# EAGLE design digAudio-rcj-tg10da1nslf (EAGLE 8.6.0)
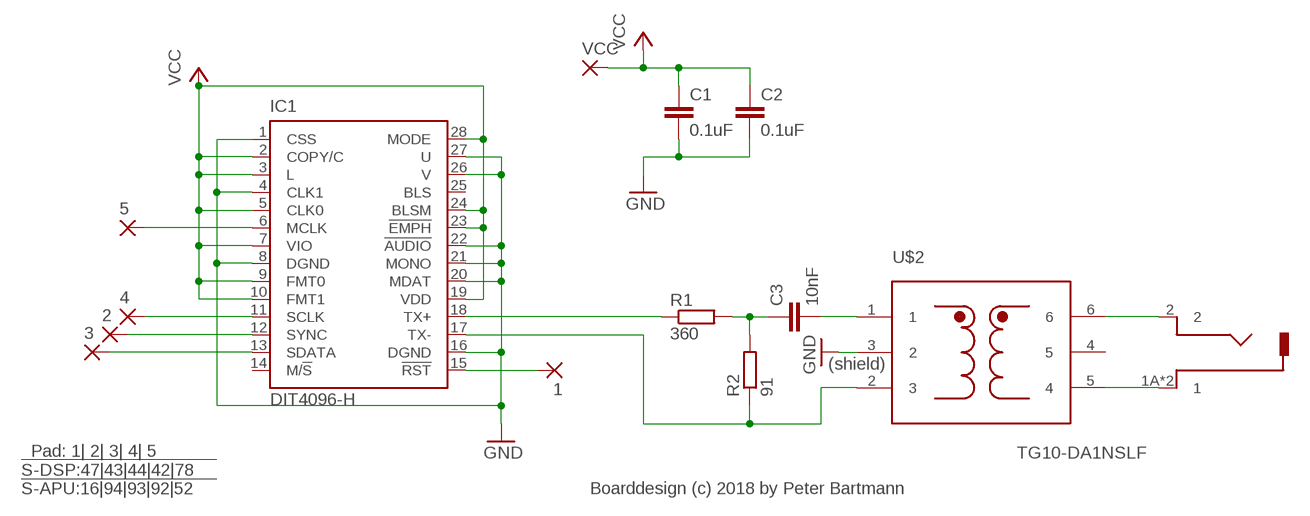
[diagram p0: schematic, sheet 1]

## Parts
1  SMD1  [SMD0,8-1,6]
2  SMD1  [SMD0,8-1,6]
3  SMD1  [SMD0,8-1,6]
4  SMD1  [SMD0,8-1,6]
5  SMD1  [SMD0,8-1,6]
C1  0.1uF  C-EUC0603  [C0603]
C2  0.1uF  C-EUC0603  [C0603]
C3  10nF  C-EUC0603  [C0603]
IC1  DIT4096-H  DIT4192-H  [PW_R-PDSO-G28]
R1  360  R-EU_R0603  [R0603]
R2  91  R-EU_R0603  [R0603]
U$1  RCJ-013-SMT-TR  RCJ_01X_SMT-MODIFIED  [RCJ_01X_SMT_MODIFIED]
U$2  TG10-DA1NSLF  [TG10-DA1NSFL]
VCC  SMD2  [SMD1,27-2,54]

## Nets
GND: C1.2 C2.2 IC1.1(CSS) IC1.4(CLK1) IC1.8(DGND) IC1.16(DGND) IC1.20(MDAT) IC1.21(MONO) IC1.22(!AUDIO) IC1.26(V) IC1.27(U) U$2.3
N$1: IC1.18(TX+) R1.1
N$2: 1.P$1(P) IC1.15(!RST)
N$3: 2.P$1(P) IC1.12(SYNC)
N$4: 4.P$1(P) IC1.11(SCLK)
N$5: 3.P$1(P) IC1.13(SDATA)
N$6: 5.P$1(P) IC1.6(MCLK)
N$7: IC1.17(TX-) R2.1 U$2.2
N$8: C3.1 R1.2 R2.2
N$9: U$1.2 U$2.6
N$10: U$1.1A U$1.1B U$2.5
N$11: C3.2 U$2.1
VCC: C1.1 C2.1 IC1.2(COPY/C) IC1.3(L) IC1.5(CLK0) IC1.7(VIO) IC1.9(FMT0) IC1.10(FMT1) IC1.19(VDD) IC1.23(!EMPH) IC1.24(BLSM) IC1.28(MODE) VCC.1(P)
Unconnected: IC1.14(M/!S) IC1.25(BLS) U$2.4

## Notes on the sheet
- (shield)
- Pad: 1| 2| 3| 4| 5
  S-DSP:47|43|44|42|78
  S-APU:16|94|93|92|52
- Boarddesign (c) 2018 by Peter Bartmann

## Library data of the parts
1-5 = wirepad:SMD1
C1-C3 = rcl:C-EU: CAPACITOR, European symbol
IC1 = texas:DIT4192-H: 192kHz Digital Audio Transmitter Hardware Mode Source: http://focus.ti.com/lit/ds/symlink/dit4192.pdf; MF: TEXAS INSTRUMENTS; MPN: DIT4192IPW; OC_FARNELL: 7455057; OC_NEWARK: 74C9511
R1 R2 = rcl:R-EU_: RESISTOR, European symbol
U$1 = digAudio_SNES:RCJ_01X_SMT
U$2 = cs8406:TG10-DA1NSLF
VCC = wirepad:SMD2: SMD PAD

## Board
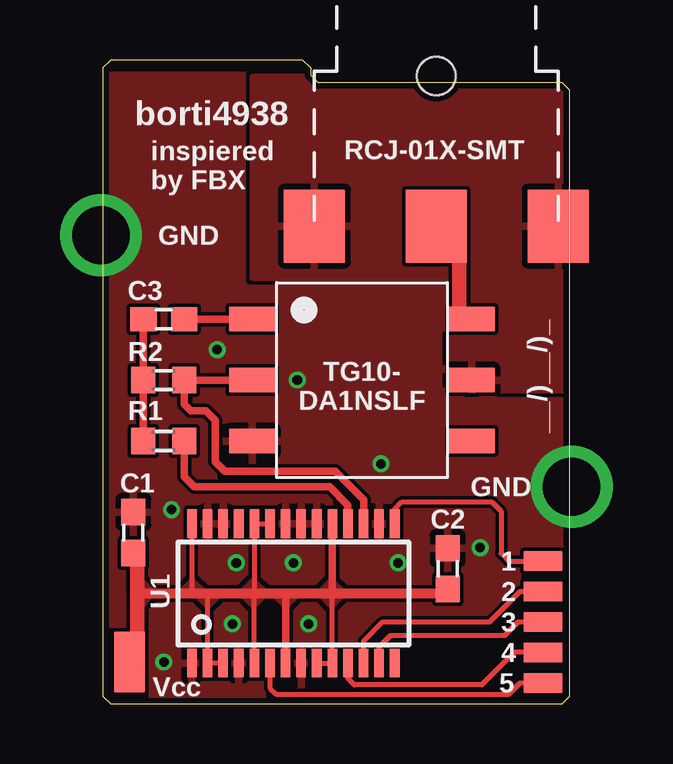
[diagram p1: board, top side]
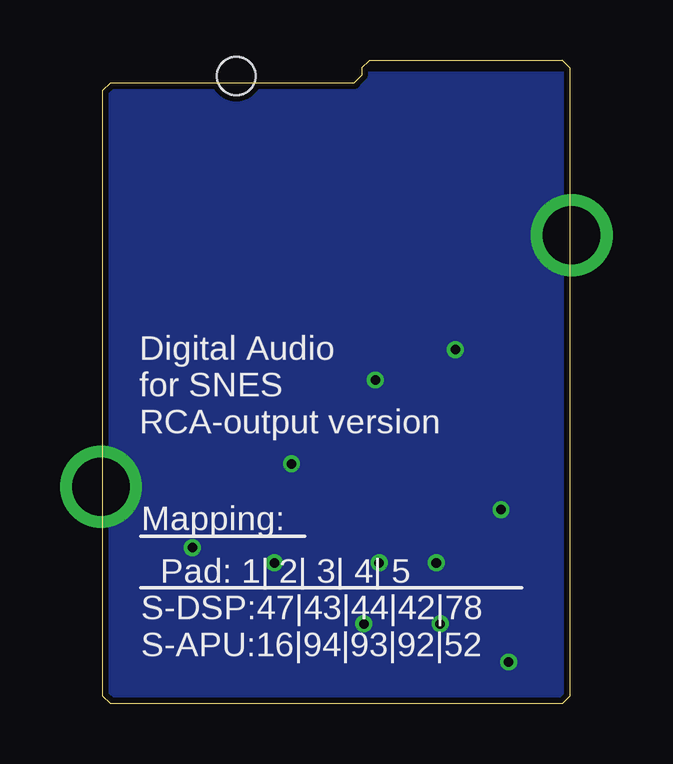
[diagram p2: board, bottom side, seen from below]

Size 19.45 x 26.83 mm. Coordinates in mm from the lower left corner, seen from the top.
Outline: 0,26.51 0,0.32 0.32,0 19.13,0 19.45,0.32 19.45,25.56 19.13,25.88 8.97,25.88 8.65,26.19 8.65,26.51 8.33,26.83 0.32,26.83 0,26.51
Copper layers (1*16): Top 0.035mm / dielectric 1.5mm / Bottom 0.035mm
Design rules "Elecrow_2-layer_eagle_rule": minimum track width 6mil, minimum drill 12mil, track to track 6mil, track to pad 6mil, pad to pad 6mil, via to via 6mil, smd to smd 0mil, copper to edge 10mil, drill to drill 10mil, minimum pad ring 10mil, minimum via ring 6mil, stop-mask expansion 2mil, vias tented up to drill 100mil, thermal gap 10mil

### Footprints (pad centres in the part's own frame; a part is rotated, then mirrored left to right if it is on the bottom)
SMD0,8-1,6 = smd 0.8 x 1.6: P$1 0,0
C0603 = smd 1.1 x 1: 1 -0.85,0; 2 0.85,0
PW_R-PDSO-G28 = smd 0.4 x 1.2: 1 -4.225,-2.9; 2 -3.575,-2.9; 3 -2.925,-2.9; 4 -2.275,-2.9; 5 -1.625,-2.9; 6 -0.975,-2.9; 7 -0.325,-2.9; 8 0.325,-2.9; 9 0.975,-2.9; 10 1.625,-2.9; 11 2.275,-2.9; 12 2.925,-2.9; 13 3.575,-2.9; 14 4.225,-2.9; 15 4.225,2.9; 16 3.575,2.9; 17 2.925,2.9; 18 2.275,2.9; 19 1.625,2.9; 20 0.975,2.9; 21 0.325,2.9; 22 -0.325,2.9; 23 -0.975,2.9; 24 -1.625,2.9; 25 -2.275,2.9; 26 -2.925,2.9; 27 -3.575,2.9; 28 -4.225,2.9
R0603 = smd 1 x 1.1: 1 -0.85,0; 2 0.85,0
RCJ_01X_SMT_MODIFIED = smd 3.048 x 2.54: 1A 0.254,-5.08; 1B 0.254,5.08; 2 0.254,0 | hole 1.6: -6,0
TG10-DA1NSFL = smd 1.905 x 1.016: 1 -4.572,2.54; 2 -4.572,0; 3 -4.572,-2.54; 4 4.572,-2.54; 5 4.572,0; 6 4.572,2.54
SMD1,27-2,54 = smd 1.27 x 2.54: 1 0,0

### Placement (x,y rotation side)
1  18.34,5.95 90 top
2  18.34,4.68 90 top
3  18.34,3.41 90 top
4  18.34,2.14 90 top
5  18.34,0.87 90 top
C1  1.27,7.14 90 top
C2  14.37,5.64 90 top
C3  2.54,16.03 0 top
IC1  7.94,4.6 0 top
R1  2.54,10.95 180 top
R2  2.54,13.49 180 top
U$1  13.89,20.16 270 top
U$2  10.79,13.49 0 top
VCC  1.11,1.75 180 top

### Tracks (layer width: path | path; a pad name or v marks a point on that pad's centre or on a via)
GND  (via drill 0.4, 2.4)
  other vias: -0.08,19.53 19.53,9.05 5.4,3.33 8.57,3.33 15.72,6.51 12.3,5.87 7.94,5.87 5.56,5.87 2.86,8.1 8.1,13.49 11.59,10 4.76,14.76 2.54,1.75
  pour Bottom (rank 6): 0.08,-0.48 19.68,-0.48 19.45,26.19 0.08,26.19
  pour Top (rank 6): 0.08,26.19 0.08,-0.48 19.68,-0.48 19.45,26.19
N$1
  Top 0.305: R1.1 3.39,9.47 3.81,9.05 9.45,9.05 10.21,8.28 IC1.18
N$2
  Top 0.203: IC1.15 12.16,8.11 12.46,8.41 16.19,8.41 16.59,8.02 16.59,6.27 16.91,5.95 1.P$1
N$3
  Top 0.203: IC1.12 10.86,2.61 11.67,3.41 16.11,3.41 17.38,4.68 2.P$1
N$4
  Top 0.203: 4.P$1 17.14,2.14 15.8,0.79 10.48,0.79 10.21,1.06 IC1.11
N$5
  Top 0.203: IC1.13 11.51,2.38 11.99,2.86 16.75,2.86 17.3,3.41 3.P$1
N$6
  Top 0.203: IC1.6 6.96,0.66 7.22,0.4 16.91,0.4 17.38,0.87 5.P$1
N$7
  Top 0.305: U$2.2 R2.1 3.39,12.48 3.65,12.22 4.29,12.22 4.68,11.83 4.68,10.08 5.08,9.68 9.68,9.68 10.86,8.5 IC1.17
N$8
  Top 0.305: R1.2 R2.2 C3.1
N$9
  Top 0.152: U$1.2 13.89,19.53
  Top 0.61: 13.89,19.53 14.84,19.53 14.84,16.03 U$2.6
N$10
  pour Top: 6.27,17.78 14.45,17.78 14.45,13.1 19.45,13.1 19.45,26.19 6.27,26.11
N$11
  Top 0.305: C3.2 U$2.1
VCC
  Top 0.203: IC1.28 3.71,4.7 3.81,4.6 | IC1.23 IC1.24 6.31,4.64 6.35,4.6 6.31,4.57 IC1.5 | 4.44,4.6 4.36,4.52 IC1.2 IC1.3 | IC1.9 IC1.10 9.56,4.6 9.52,4.6
  Top 0.305: IC1.7 7.61,4.6 7.62,4.6 | IC1.19 9.56,4.64 9.52,4.6
  Top 0.406: 1.43,4.6 3.81,4.6 4.44,4.6 6.35,4.6 7.62,4.6 9.52,4.6 14.11,4.6 C2.1
  Top 0.61: C1.1 1.43,6.13 1.43,4.6 1.43,1.75 VCC.1
  pour Top: 3.73,5.16 3.17,4.6 4.29,4.6
  pour Top: 6.27,5.16 5.71,4.6 6.83,4.6
  pour Top: 9.53,5.16 8.97,4.6 10.08,4.6
  pour Top: 7.62,4.05 8.18,4.6 7.06,4.6
  pour Top: 6.27,4.05 6.83,4.6 5.71,4.6
  pour Top: 4.37,4.05 4.92,4.6 3.81,4.6
  pour Top: 9.53,4.05 10.08,4.6 8.97,4.6
  pour Top: 2.14,4.6 1.43,5.32 1.43,3.89

### Text on the board
tNames: borti4938 | RCJ-01X-SMT | inspiered / by FBX | GND | C3 | R2 | TG10- / DA1NSLF | R1 | __/)__/)_ | C1 | GND | C2 | 1 | 2 | U1 | 3 | 4 | Vcc | 5
bNames: Digital Audio / for SNES / RCA-output version | Mapping: | Pad: 1| 2| 3| 4| 5 / S-DSP:47|43|44|42|78 / S-APU:16|94|93|92|52